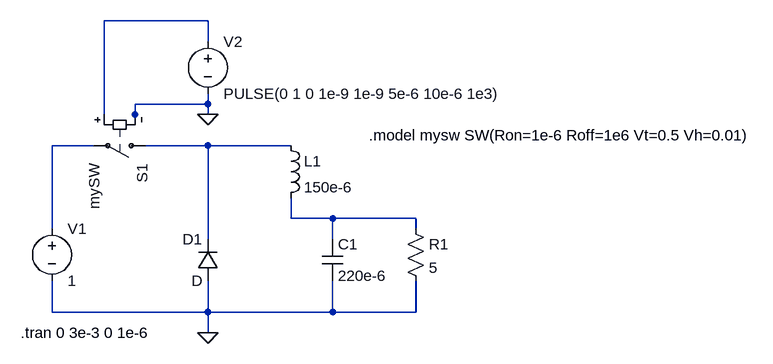
[diagram p0: schematic DCDCbuck.asc]
DCDCbuck.asc, the LTspice schematic file:
Version 4
SHEET 1 1256 680
WIRE 64 32 -96 32
WIRE 64 64 64 32
WIRE 64 160 64 144
WIRE 64 160 -48 160
WIRE -96 176 -96 32
WIRE -48 176 -48 160
WIRE 64 176 64 160
WIRE -48 192 -48 176
WIRE -112 224 -176 224
WIRE 64 224 -32 224
WIRE 192 224 64 224
WIRE 192 336 192 304
WIRE 256 336 192 336
WIRE 384 336 256 336
WIRE -176 352 -176 224
WIRE 384 352 384 336
WIRE 64 368 64 224
WIRE 256 368 256 336
WIRE -176 480 -176 432
WIRE 64 480 64 432
WIRE 64 480 -176 480
WIRE 256 480 256 432
WIRE 256 480 64 480
WIRE 384 480 384 432
WIRE 384 480 256 480
WIRE 64 512 64 480
FLAG 64 176 0
FLAG 64 512 0
SYMBOL voltage -176 336 R0
SYMATTR InstName V1
SYMATTR Value 1
SYMBOL diode 80 432 R180
WINDOW 0 24 64 Left 2
WINDOW 3 24 0 Left 2
SYMATTR InstName D1
SYMBOL res 368 336 R0
SYMATTR InstName R1
SYMATTR Value 5
SYMBOL ind 176 208 R0
SYMATTR InstName L1
SYMATTR Value 150e-6
SYMBOL sw -16 224 R90
WINDOW 0 28 95 Left 2
WINDOW 3 28 21 Left 2
SYMATTR InstName mySW
SYMATTR SpiceModel mysw
SYMATTR Value S1
SYMBOL voltage 64 48 R0
SYMATTR InstName V2
SYMATTR Value PULSE(0 1 0 1e-9 1e-9 5e-6 10e-6 1e3)
SYMBOL cap 240 368 R0
SYMATTR InstName C1
SYMATTR Value 220e-6
TEXT 312 208 Left 2 !.model mysw SW(Ron=1e-6 Roff=1e6 Vt=0.5 Vh=0.01)
TEXT -224 512 Left 2 !.tran 0 3e-3 0 1e-6

The netlist it stands for:
* DCDCbuck.asc
V1 N002 0 1
D1 0 N003 D
R1 N004 0 5
L1 N003 N004 150e-6
S§mySW N003 N002 N001 0 mysw S1
V2 N001 0 PULSE(0 1 0 1e-9 1e-9 5e-6 10e-6 1e3)
C1 N004 0 220e-6
.model D D
.lib standard.dio
.model mysw SW(Ron=1e-6 Roff=1e6 Vt=0.5 Vh=0.01)
.tran 0 3e-3 0 1e-6
.backanno
.end